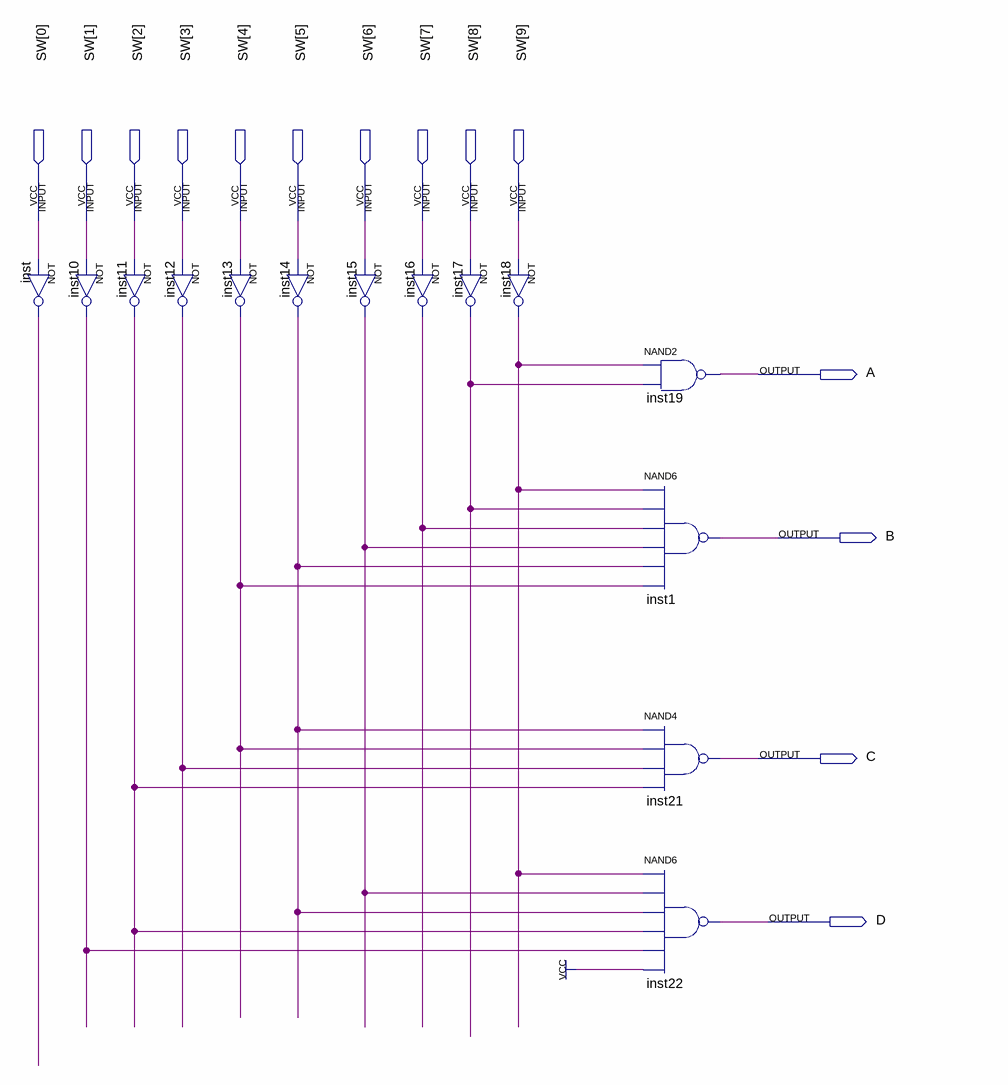
[diagram p0: schematic sheet]
// Quartus schematic codificador.bdf as structural Verilog: 14 symbols, 14 pins
module codificador (
  input  [9:0] SW,
  output A,
  output B,
  output C,
  output D
);

  wire inst10_out, inst11_out, inst12_out, inst13_out, inst14_out, inst15_out, inst16_out, inst17_out,
       inst18_out, inst_out;

  not inst (inst_out, SW[0]);
  not inst10 (inst10_out, SW[1]);
  not inst11 (inst11_out, SW[2]);
  not inst12 (inst12_out, SW[3]);
  not inst13 (inst13_out, SW[4]);
  not inst14 (inst14_out, SW[5]);
  not inst15 (inst15_out, SW[6]);
  not inst16 (inst16_out, SW[7]);
  not inst17 (inst17_out, SW[8]);
  not inst18 (inst18_out, SW[9]);
  nand inst19 (A, inst18_out, inst17_out);
  nand inst1 (B, inst18_out, inst17_out, inst16_out, inst15_out, inst14_out, inst13_out);
  nand inst21 (C, inst14_out, inst13_out, inst12_out, inst11_out);
  nand inst22 (D, inst18_out, inst15_out, inst14_out, inst11_out, inst10_out, 1'b1);
endmodule
